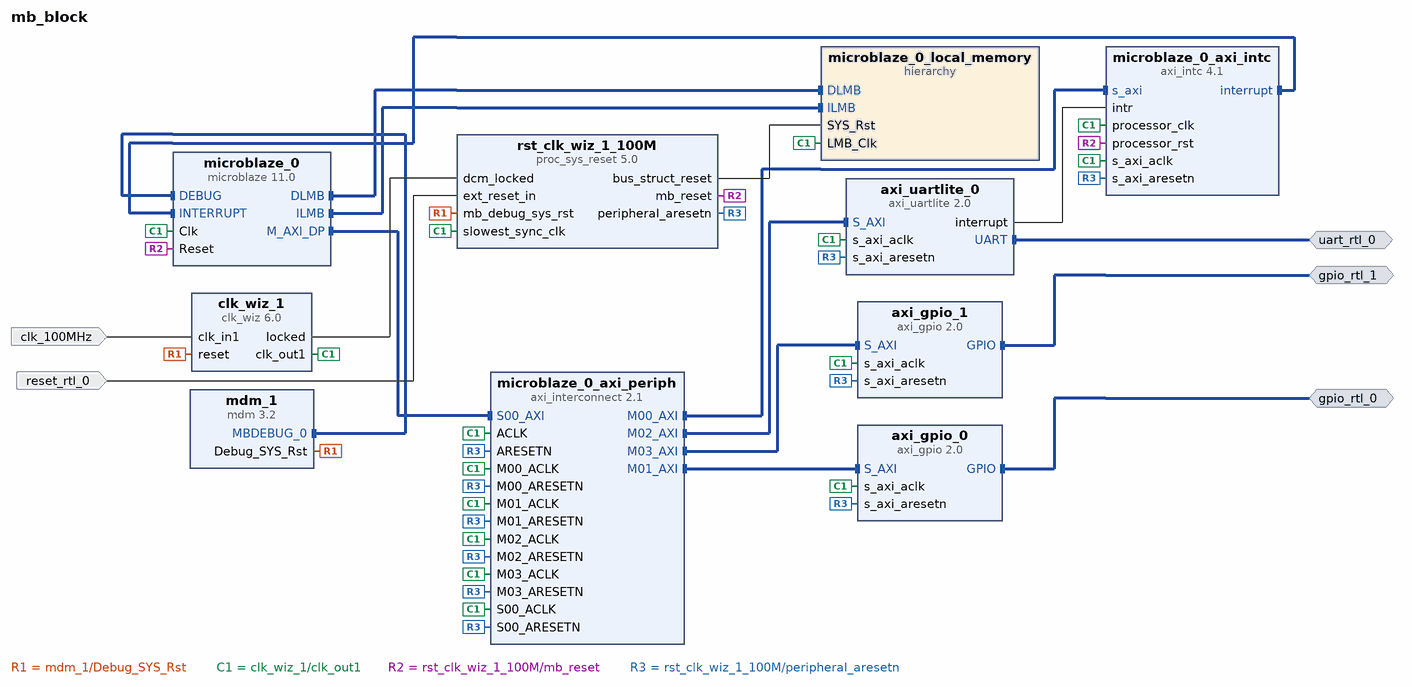
[diagram p0: block diagram of the top level]
# Vivado block design mb_block, xc7s50csga324-1, Vivado 2022.2
create_bd_design mb_block

create_bd_intf_port -mode Master -vlnv xilinx.com:interface:gpio_rtl:1.0 gpio_rtl_0
create_bd_intf_port -mode Master -vlnv xilinx.com:interface:uart_rtl:1.0 uart_rtl_0
create_bd_intf_port -mode Master -vlnv xilinx.com:interface:gpio_rtl:1.0 gpio_rtl_1
create_bd_port -dir I -type rst reset_rtl_0
set_property -dict {CONFIG.POLARITY ACTIVE_LOW} [get_bd_ports reset_rtl_0]
create_bd_port -dir I -type clk clk_100MHz
set_property -dict {CONFIG.FREQ_HZ 100000000} [get_bd_ports clk_100MHz]

create_bd_cell -type ip -vlnv xilinx.com:ip:microblaze:11.0 microblaze_0
set_property -dict [list \
  CONFIG.C_DEBUG_ENABLED 1 \
  CONFIG.C_D_AXI 1 \
  CONFIG.C_D_LMB 1 \
  CONFIG.C_I_LMB 1 \
  CONFIG.G_TEMPLATE_LIST 8 \
] [get_bd_cells microblaze_0]
create_bd_cell -type hier microblaze_0_local_memory
create_bd_cell -type ip -vlnv xilinx.com:ip:axi_interconnect:2.1 microblaze_0_axi_periph
set_property -dict {CONFIG.NUM_MI 4} [get_bd_cells microblaze_0_axi_periph]
create_bd_cell -type ip -vlnv xilinx.com:ip:axi_intc:4.1 microblaze_0_axi_intc
set_property -dict {CONFIG.C_HAS_FAST 1} [get_bd_cells microblaze_0_axi_intc]
create_bd_cell -type ip -vlnv xilinx.com:ip:mdm:3.2 mdm_1
create_bd_cell -type ip -vlnv xilinx.com:ip:clk_wiz:6.0 clk_wiz_1
set_property -dict {CONFIG.PRIM_SOURCE Single_ended_clock_capable_pin} [get_bd_cells clk_wiz_1]
create_bd_cell -type ip -vlnv xilinx.com:ip:proc_sys_reset:5.0 rst_clk_wiz_1_100M
create_bd_cell -type ip -vlnv xilinx.com:ip:axi_gpio:2.0 axi_gpio_0
set_property -dict {CONFIG.C_ALL_OUTPUTS 1 CONFIG.C_GPIO_WIDTH 16} [get_bd_cells axi_gpio_0]
create_bd_cell -type ip -vlnv xilinx.com:ip:axi_uartlite:2.0 axi_uartlite_0
set_property -dict {CONFIG.C_BAUDRATE 115200} [get_bd_cells axi_uartlite_0]
create_bd_cell -type ip -vlnv xilinx.com:ip:axi_gpio:2.0 axi_gpio_1
set_property -dict {CONFIG.C_ALL_INPUTS 1 CONFIG.C_GPIO_WIDTH 17} [get_bd_cells axi_gpio_1]

# ---- hierarchy /microblaze_0_local_memory ----
current_bd_instance /microblaze_0_local_memory
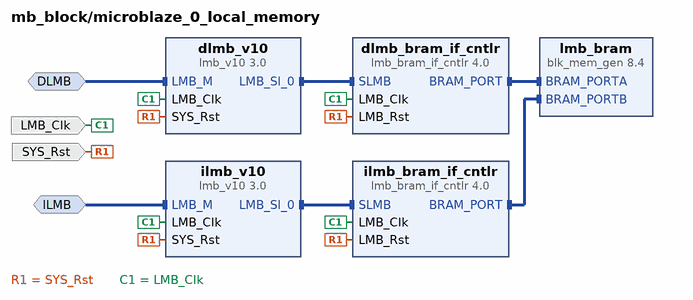
[diagram p1: block diagram inside /microblaze_0_local_memory]
create_bd_intf_pin -mode MirroredMaster -vlnv xilinx.com:interface:lmb_rtl:1.0 DLMB
create_bd_intf_pin -mode MirroredMaster -vlnv xilinx.com:interface:lmb_rtl:1.0 ILMB
create_bd_pin -dir I -type clk LMB_Clk
create_bd_pin -dir I -type rst SYS_Rst

create_bd_cell -type ip -vlnv xilinx.com:ip:lmb_v10:3.0 dlmb_v10
create_bd_cell -type ip -vlnv xilinx.com:ip:lmb_v10:3.0 ilmb_v10
create_bd_cell -type ip -vlnv xilinx.com:ip:lmb_bram_if_cntlr:4.0 dlmb_bram_if_cntlr
set_property -dict {CONFIG.C_ECC 0} [get_bd_cells dlmb_bram_if_cntlr]
create_bd_cell -type ip -vlnv xilinx.com:ip:lmb_bram_if_cntlr:4.0 ilmb_bram_if_cntlr
set_property -dict {CONFIG.C_ECC 0} [get_bd_cells ilmb_bram_if_cntlr]
create_bd_cell -type ip -vlnv xilinx.com:ip:blk_mem_gen:8.4 lmb_bram
set_property -dict {CONFIG.Memory_Type True_Dual_Port_RAM CONFIG.use_bram_block BRAM_Controller} [get_bd_cells lmb_bram]

# ---- connections ----

current_bd_instance /microblaze_0_local_memory
connect_bd_intf_net -intf_net microblaze_0_dlmb [get_bd_intf_pins DLMB] [get_bd_intf_pins dlmb_v10/LMB_M]
connect_bd_intf_net -intf_net microblaze_0_dlmb_bus [get_bd_intf_pins dlmb_v10/LMB_Sl_0] [get_bd_intf_pins dlmb_bram_if_cntlr/SLMB]
connect_bd_intf_net -intf_net microblaze_0_dlmb_cntlr [get_bd_intf_pins dlmb_bram_if_cntlr/BRAM_PORT] [get_bd_intf_pins lmb_bram/BRAM_PORTA]
connect_bd_intf_net -intf_net microblaze_0_ilmb [get_bd_intf_pins ILMB] [get_bd_intf_pins ilmb_v10/LMB_M]
connect_bd_intf_net -intf_net microblaze_0_ilmb_bus [get_bd_intf_pins ilmb_v10/LMB_Sl_0] [get_bd_intf_pins ilmb_bram_if_cntlr/SLMB]
connect_bd_intf_net -intf_net microblaze_0_ilmb_cntlr [get_bd_intf_pins ilmb_bram_if_cntlr/BRAM_PORT] [get_bd_intf_pins lmb_bram/BRAM_PORTB]
connect_bd_net [get_bd_pins SYS_Rst] \
  [get_bd_pins dlmb_v10/SYS_Rst] [get_bd_pins dlmb_bram_if_cntlr/LMB_Rst] [get_bd_pins ilmb_v10/SYS_Rst] \
  [get_bd_pins ilmb_bram_if_cntlr/LMB_Rst]
connect_bd_net -net microblaze_0_Clk [get_bd_pins LMB_Clk] \
  [get_bd_pins dlmb_v10/LMB_Clk] [get_bd_pins dlmb_bram_if_cntlr/LMB_Clk] [get_bd_pins ilmb_v10/LMB_Clk] \
  [get_bd_pins ilmb_bram_if_cntlr/LMB_Clk]
set_property HDL_ATTRIBUTE.BMM_INFO_ADDRESS_SPACE {byte  0x00000000 32 > mb_block microblaze_0_local_memory/lmb_bram} [get_bd_cells dlmb_bram_if_cntlr]
set_property HDL_ATTRIBUTE.KEEP_HIERARCHY yes [get_bd_cells dlmb_bram_if_cntlr]

current_bd_instance /
connect_bd_intf_net [get_bd_intf_ports gpio_rtl_0] [get_bd_intf_pins axi_gpio_0/GPIO]
connect_bd_intf_net [get_bd_intf_ports gpio_rtl_1] [get_bd_intf_pins axi_gpio_1/GPIO]
connect_bd_intf_net [get_bd_intf_ports uart_rtl_0] [get_bd_intf_pins axi_uartlite_0/UART]
connect_bd_intf_net -intf_net microblaze_0_axi_dp [get_bd_intf_pins microblaze_0_axi_periph/S00_AXI] [get_bd_intf_pins microblaze_0/M_AXI_DP]
connect_bd_intf_net [get_bd_intf_pins microblaze_0_axi_periph/M01_AXI] [get_bd_intf_pins axi_gpio_0/S_AXI]
connect_bd_intf_net [get_bd_intf_pins microblaze_0_axi_periph/M02_AXI] [get_bd_intf_pins axi_uartlite_0/S_AXI]
connect_bd_intf_net [get_bd_intf_pins microblaze_0_axi_periph/M03_AXI] [get_bd_intf_pins axi_gpio_1/S_AXI]
connect_bd_intf_net [get_bd_intf_pins mdm_1/MBDEBUG_0] [get_bd_intf_pins microblaze_0/DEBUG]
connect_bd_intf_net [get_bd_intf_pins microblaze_0/DLMB] [get_bd_intf_pins microblaze_0_local_memory/DLMB]
connect_bd_intf_net [get_bd_intf_pins microblaze_0/ILMB] [get_bd_intf_pins microblaze_0_local_memory/ILMB]
connect_bd_intf_net -intf_net microblaze_0_intc_axi [get_bd_intf_pins microblaze_0_axi_periph/M00_AXI] [get_bd_intf_pins microblaze_0_axi_intc/s_axi]
connect_bd_intf_net [get_bd_intf_pins microblaze_0_axi_intc/interrupt] [get_bd_intf_pins microblaze_0/INTERRUPT]
connect_bd_net [get_bd_pins axi_uartlite_0/interrupt] [get_bd_pins microblaze_0_axi_intc/intr]
connect_bd_net [get_bd_ports clk_100MHz] [get_bd_pins clk_wiz_1/clk_in1]
connect_bd_net [get_bd_pins clk_wiz_1/locked] [get_bd_pins rst_clk_wiz_1_100M/dcm_locked]
connect_bd_net [get_bd_pins mdm_1/Debug_SYS_Rst] [get_bd_pins rst_clk_wiz_1_100M/mb_debug_sys_rst] [get_bd_pins clk_wiz_1/reset]
connect_bd_net -net microblaze_0_Clk [get_bd_pins clk_wiz_1/clk_out1] \
  [get_bd_pins microblaze_0/Clk] [get_bd_pins microblaze_0_axi_periph/ACLK] [get_bd_pins microblaze_0_axi_periph/S00_ACLK] \
  [get_bd_pins microblaze_0_axi_periph/M00_ACLK] [get_bd_pins microblaze_0_axi_intc/s_axi_aclk] \
  [get_bd_pins microblaze_0_axi_intc/processor_clk] [get_bd_pins microblaze_0_local_memory/LMB_Clk] \
  [get_bd_pins rst_clk_wiz_1_100M/slowest_sync_clk] [get_bd_pins axi_gpio_0/s_axi_aclk] \
  [get_bd_pins microblaze_0_axi_periph/M01_ACLK] [get_bd_pins axi_uartlite_0/s_axi_aclk] \
  [get_bd_pins microblaze_0_axi_periph/M02_ACLK] [get_bd_pins axi_gpio_1/s_axi_aclk] \
  [get_bd_pins microblaze_0_axi_periph/M03_ACLK]
connect_bd_net -net reset_rtl_0_1 [get_bd_ports reset_rtl_0] [get_bd_pins rst_clk_wiz_1_100M/ext_reset_in]
connect_bd_net [get_bd_pins rst_clk_wiz_1_100M/bus_struct_reset] [get_bd_pins microblaze_0_local_memory/SYS_Rst]
connect_bd_net [get_bd_pins rst_clk_wiz_1_100M/mb_reset] [get_bd_pins microblaze_0/Reset] [get_bd_pins microblaze_0_axi_intc/processor_rst]
connect_bd_net [get_bd_pins rst_clk_wiz_1_100M/peripheral_aresetn] \
  [get_bd_pins microblaze_0_axi_periph/ARESETN] [get_bd_pins microblaze_0_axi_periph/S00_ARESETN] \
  [get_bd_pins microblaze_0_axi_periph/M00_ARESETN] [get_bd_pins microblaze_0_axi_intc/s_axi_aresetn] \
  [get_bd_pins axi_gpio_0/s_axi_aresetn] [get_bd_pins microblaze_0_axi_periph/M01_ARESETN] \
  [get_bd_pins axi_uartlite_0/s_axi_aresetn] [get_bd_pins microblaze_0_axi_periph/M02_ARESETN] \
  [get_bd_pins axi_gpio_1/s_axi_aresetn] [get_bd_pins microblaze_0_axi_periph/M03_ARESETN]
set_property HDL_ATTRIBUTE.BMM_INFO_PROCESSOR {microblaze-le > mb_block microblaze_0_local_memory/dlmb_bram_if_cntlr} [get_bd_cells microblaze_0]
set_property HDL_ATTRIBUTE.KEEP_HIERARCHY yes [get_bd_cells microblaze_0]

# ---- address map ----
assign_bd_address -offset 0x00000000 -range 32K -target_address_space [get_bd_addr_spaces microblaze_0/Data] [get_bd_addr_segs microblaze_0_local_memory/dlmb_bram_if_cntlr/SLMB/Mem]
assign_bd_address -offset 0x40000000 -range 64K -target_address_space [get_bd_addr_spaces microblaze_0/Data] [get_bd_addr_segs axi_gpio_0/S_AXI/Reg]
assign_bd_address -offset 0x40010000 -range 64K -target_address_space [get_bd_addr_spaces microblaze_0/Data] [get_bd_addr_segs axi_gpio_1/S_AXI/Reg]
assign_bd_address -offset 0x40600000 -range 64K -target_address_space [get_bd_addr_spaces microblaze_0/Data] [get_bd_addr_segs axi_uartlite_0/S_AXI/Reg]
assign_bd_address -offset 0x41200000 -range 64K -target_address_space [get_bd_addr_spaces microblaze_0/Data] [get_bd_addr_segs microblaze_0_axi_intc/S_AXI/Reg]
assign_bd_address -offset 0x00000000 -range 32K -target_address_space [get_bd_addr_spaces microblaze_0/Instruction] [get_bd_addr_segs microblaze_0_local_memory/ilmb_bram_if_cntlr/SLMB/Mem]

validate_bd_design
save_bd_design
